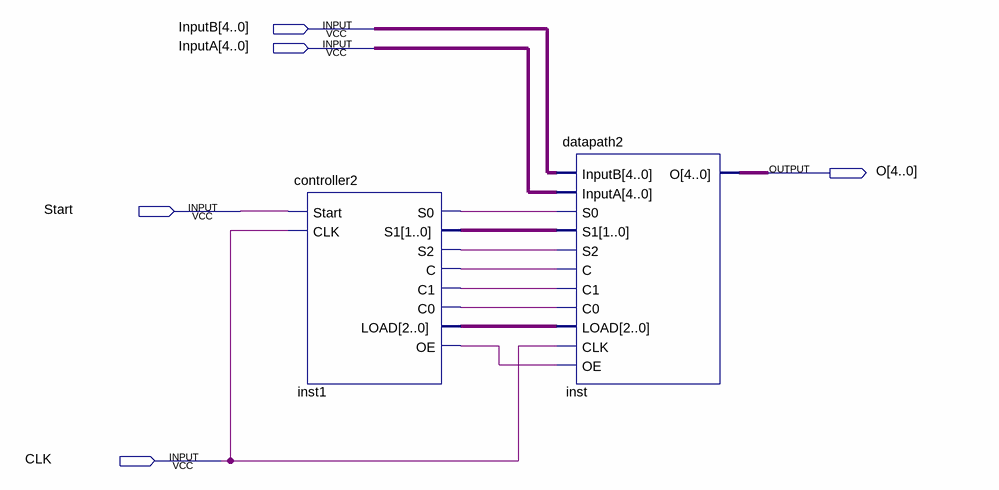
[diagram p0: schematic sheet]
// Quartus schematic FUS.bdf as structural Verilog: 2 symbols, 5 pins
module FUS (
  input  [4:0] InputB,
  input  [4:0] InputA,
  input  Start,
  input  CLK,
  output [4:0] O
);

  wire inst1_c, inst1_c0, inst1_c1, inst1_oe, inst1_s0, inst1_s2;
  wire [1:0] inst1_s1;
  wire [2:0] inst1_load;

  controller2 inst1 (
    .Start(Start), .CLK(CLK), .S0(inst1_s0), .S1(inst1_s1), .S2(inst1_s2), .C(inst1_c), .C1(inst1_c1),
    .C0(inst1_c0), .LOAD(inst1_load), .OE(inst1_oe));
  datapath2 inst (
    .InputB(InputB), .InputA(InputA), .S0(inst1_s0), .S1(inst1_s1), .S2(inst1_s2), .C(inst1_c),
    .C1(inst1_c1), .C0(inst1_c0), .LOAD(inst1_load), .CLK(CLK), .OE(inst1_oe), .O(O));
endmodule
